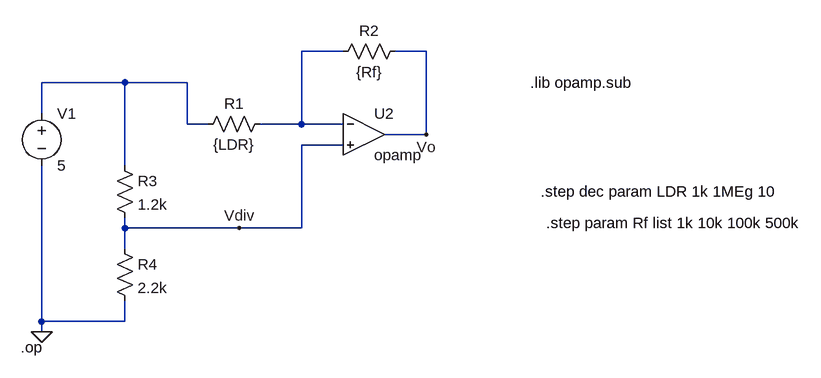
[diagram p0: schematic ldr_conditioning.asc]
ldr_conditioning.asc, the LTspice schematic file:
Version 4.1
SHEET 1 2352 4768
WIRE 352 48 288 48
WIRE 480 48 432 48
WIRE 16 96 -112 96
WIRE 112 96 16 96
WIRE -112 144 -112 96
WIRE 112 160 112 96
WIRE 144 160 112 160
WIRE 288 160 288 48
WIRE 288 160 224 160
WIRE 352 160 288 160
WIRE 480 176 480 48
WIRE 480 176 416 176
WIRE 352 192 288 192
WIRE 16 224 16 96
WIRE 16 320 16 304
WIRE 192 320 16 320
WIRE 288 320 288 192
WIRE 288 320 192 320
WIRE 16 352 16 320
WIRE -112 464 -112 224
WIRE 16 464 16 432
WIRE 16 464 -112 464
WIRE -112 480 -112 464
FLAG -112 480 0
FLAG 192 320 Vdiv
FLAG 480 176 Vo
SYMBOL res 240 144 R90
WINDOW 0 0 56 VBottom 2
WINDOW 3 32 56 VTop 2
SYMATTR InstName R1
SYMATTR Value {LDR}
SYMBOL res 448 32 R90
WINDOW 0 0 56 VBottom 2
WINDOW 3 32 56 VTop 2
SYMATTR InstName R2
SYMATTR Value {Rf}
SYMBOL voltage -112 128 R0
SYMATTR InstName V1
SYMATTR Value 5
SYMBOL res 0 208 R0
SYMATTR InstName R3
SYMATTR Value 1.2k
SYMBOL res 0 336 R0
SYMATTR InstName R4
SYMATTR Value 2.2k
SYMBOL OpAmps\\opamp 384 112 R0
SYMATTR InstName U2
TEXT 640 96 Left 2 !.lib opamp.sub
TEXT -144 504 Left 2 !.op
TEXT 656 264 Left 2 !.step dec param LDR 1k 1MEg 10
TEXT 664 312 Left 2 !.step param Rf list 1k 10k 100k 500k

The netlist it stands for:
* ldr_conditioning.asc
R1 N001 N002 {LDR}
R2 Vo N001 {Rf}
V1 N002 0 5
R3 N002 Vdiv 1.2k
R4 Vdiv 0 2.2k
X§U2 N001 Vdiv Vo opamp Aol=100K GBW=10Meg  ; pins invin noninvin out
.lib opamp.sub
.op
.step dec param LDR 1k 1MEg 10
.step param Rf list 1k 10k 100k 500k
.backanno
.end